# Altium schematic sheet DRV8301.SchDoc
size A4
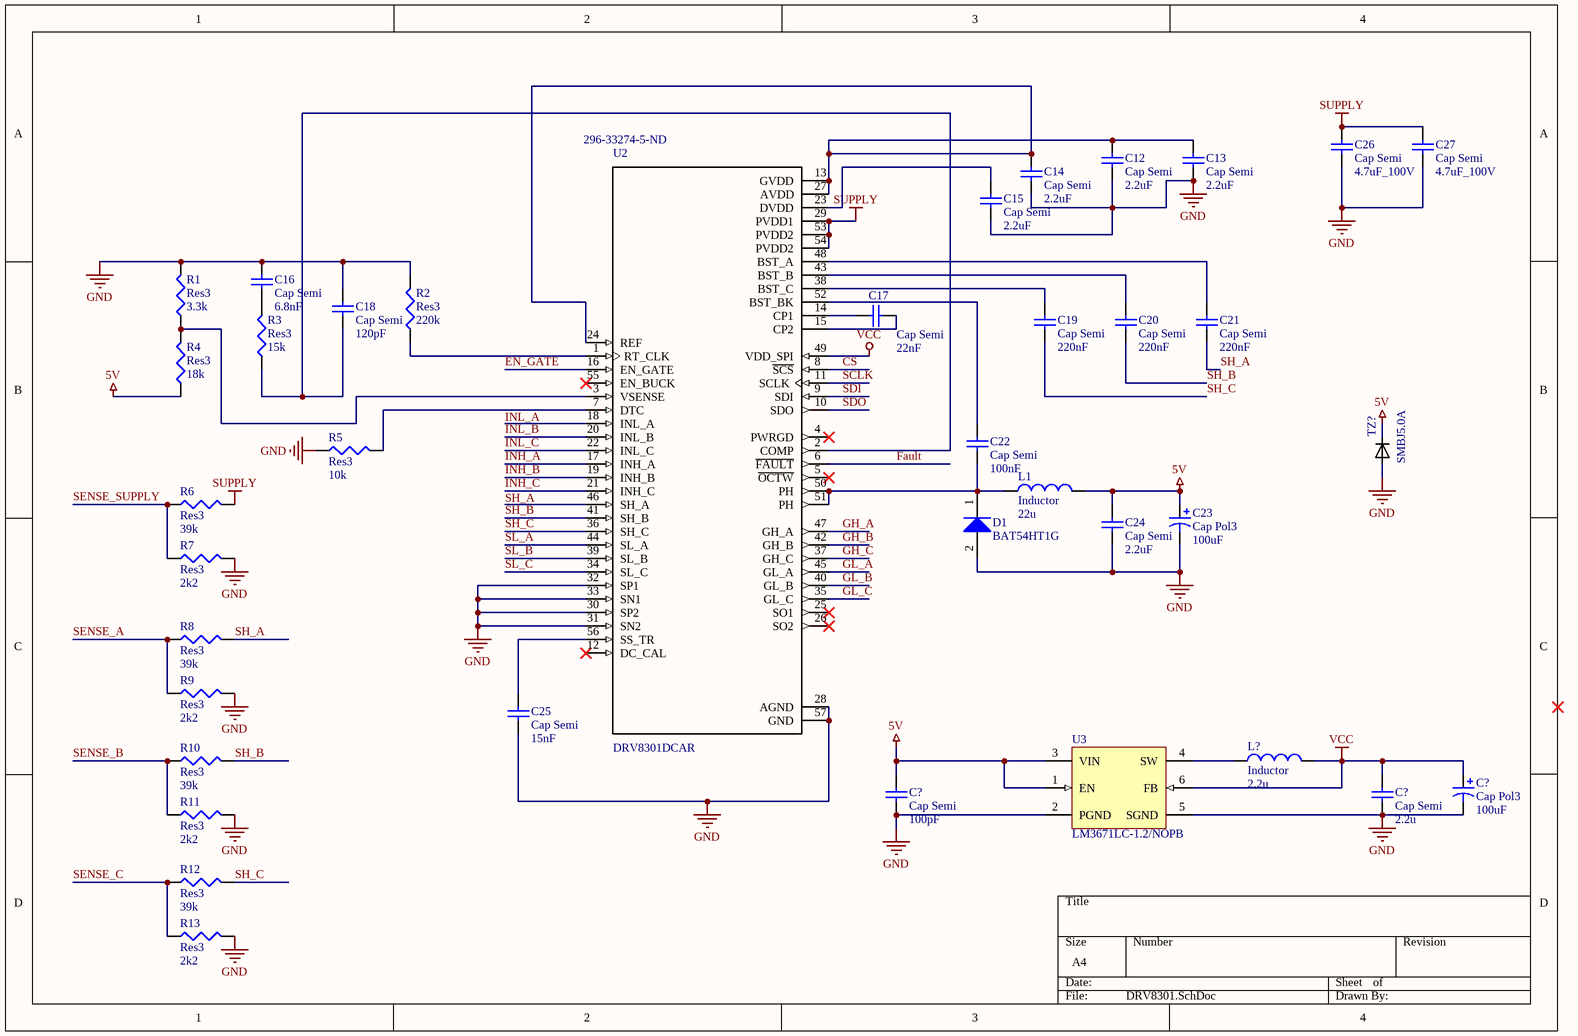
[diagram p0: DRV8301.SchDoc]

## Parts
(Parts that share a designator on the sheet are numbered #1, #2 ... from top to bottom, then left to right.)
C12  Cap Semi  value 2.2uF  [C1206]
C13  Cap Semi  value 2.2uF  [C1206]
C14  Cap Semi  value 2.2uF  [C1206]
C15  Cap Semi  value 2.2uF  [C1206]
C16  Cap Semi  value 6.8nF  [C1206]
C17  Cap Semi  value 22nF  [C1206]
C18  Cap Semi  value 120pF  [C1206]
C19  Cap Semi  value 220nF  [C1206]
C20  Cap Semi  value 220nF  [C1206]
C21  Cap Semi  value 220nF  [C1206]
C22  Cap Semi  value 100nF  [C1206]
C23  Cap Pol3  value 100uF  [C0805]
C24  Cap Semi  value 2.2uF  [C1206]
C25  Cap Semi  value 15nF  [C1206]
C26  Cap Semi  value 4.7uF_100V  [C1206]
C27  Cap Semi  value 4.7uF_100V  [C1206]
C?#1  Cap Pol3  value 100uF  [C0805]
C?#2  Cap Semi  value 100pF  [C1206]
C?#3  Cap Semi  value 2.2u  [C1206]
D1  BAT54HT1G  [ONSC-SOD-323-2-477-02_V]
L1  Inductor  value 22u  [0402-A]
L?  Inductor  value 2.2u  [0402-A]
R1  Res3  value 3.3k  [J1-0603]
R2  Res3  value 220k  [J1-0603]
R3  Res3  value 15k  [J1-0603]
R4  Res3  value 18k  [J1-0603]
R5  Res3  value 10k  [J1-0603]
R6  Res3  value 39k  [J1-0603]
R7  Res3  value 2k2  [J1-0603]
R8  Res3  value 39k  [J1-0603]
R9  Res3  value 2k2  [J1-0603]
R10  Res3  value 39k  [J1-0603]
R11  Res3  value 2k2  [J1-0603]
R12  Res3  value 39k  [J1-0603]
R13  Res3  value 2k2  [J1-0603]
TZ?  SMBJ5.0A  [*SMB_SMBJ5.0A(Primary)]
U2  DRV8301DCAR  Supplier Part Number 1: 296-33274-5-ND  [*SOP50P810X120-57N]
U3  LM3671LC-1.2/NOPB  [NKH0006B_V]

## Nets
5V: C23.1 C24.2 C?#2.2 L1.2 R4.1 TZ?.C U3.1(EN) U3.3(VIN)
GND: C12.2 C13.2 C14.2 C15.2 C16.2 C18.2 C23.2 C24.1 C25.2 C26.1 C27.1 C?#1.2 C?#2.1 C?#3.1 D1.2(A) R1.2 R2.2 R5.1 R7.2 R9.2 R11.2 R13.2 TZ?.A U2.28(AGND) U2.30(SP2) U2.31(SN2) U2.32(SP1) U2.33(SN1) U2.57(GND) U3.2(PGND) U3.5(SGND)
SUPPLY: C26.2 C27.2 R6.2 U2.29(PVDD1) U2.53(PVDD2) U2.54(PVDD2)
VCC: C?#1.1 C?#3.2 L?.2 U2.49(VDD_SPI) U3.6(FB)
CS: U2.8(~{SCS})
EN_GATE: U2.16(EN_GATE)
Fault: U2.6(~{FAULT})
GH_A: U2.47(GH_A)
GH_B: U2.42(GH_B)
GH_C: U2.37(GH_C)
GL_A: U2.45(GL_A)
GL_B: U2.40(GL_B)
GL_C: U2.35(GL_C)
INH_A: U2.17(INH_A)
INH_B: U2.19(INH_B)
INH_C: U2.21(INH_C)
INL_B: U2.20(INL_B)
INL_C: U2.22(INL_C)
SCLK: U2.11(SCLK)
SDI: U2.9(SDI)
SDO: U2.10(SDO)
SENSE_A: R8.1 R9.1
SENSE_B: R10.1 R11.1
SENSE_C: R12.1 R13.1
SENSE_SUPPLY: R6.1 R7.1
SH_A: C21.2 R8.2
SH_B: C20.2 R10.2 U2.41(SH_B)
SH_C: C19.2 R12.2 U2.36(SH_C)
SL_A: U2.44(SL_A)
SL_B: U2.39(SL_B)
SL_C: U2.34(SL_C)
NetC12_1: C12.1 C13.1 C14.1 U2.13(GVDD) U2.24(REF) U2.27(AVDD)
NetC15_1: C15.1 U2.23(DVDD)
NetC16_1: C16.1 R3.2
NetC17_1: C17.1 U2.14(CP1)
NetC17_2: C17.2 U2.15(CP2)
NetC18_1: C18.1 R3.1 U2.2(COMP)
NetC19_1: C19.1 U2.38(BST_C)
NetC20_1: C20.1 U2.43(BST_B)
NetC21_1: C21.1 U2.48(BST_A)
NetC22_1: C22.1 D1.1(K) L1.1 U2.50(PH) U2.51(PH)
NetC22_2: C22.2 U2.52(BST_BK)
NetC25_1: C25.1 U2.56(SS_TR)
NetL?_1: L?.1 U3.4(SW)
NetR1_1: R1.1 R4.2 U2.3(VSENSE)
NetR2_1: R2.1 U2.1(RT_CLK)
NetR5_2: R5.2 U2.7(DTC)

Not connected (* = marked no-connect by the designer): U2 4(PWRGD)* 5(~{OCTW})* 12(DC_CAL)* 18(INL_A) 25(SO1)* 26(SO2)* 46(SH_A) 55(EN_BUCK)*

## Notes on the sheet
- Labels drawn without touching a wire or pin: INL_A, SH_A

## Library data of the parts
C12-C22 C24-C27 C?#2 C?#3 = Cap Semi: Capacitor (Semiconductor SIM Model); Published: 8-Jun-2000; LatestRevisionDate: 29-May-2009; LatestRevisionNote: IPC-7351 Footprint Added.; PackageReference: C1206; Publisher: Altium Limited; PackageDescription: Chip Capacitor
C23 C?#1 = Cap Pol3: Polarized Capacitor (Surface Mount); Published: 8-Jun-2000; LatestRevisionDate: 29-May-2009; LatestRevisionNote: IPC-7351 Footprint Added.; PackageReference: C0805; Publisher: Altium Limited; PackageDescription: Chip Capacitor
D1 = CMP-1055-00462-1: Schottky Barrier Diode, 2-Pin SOD-323, Pb-Free, Tape and Reel; Manufacturer: On Semiconductor; Configuration: Single; trr Max (ns): 5; IFSM Max (A): 0.6; ComponentLink3URL: http://www.onsemi.com/pub_link/Collateral/477-02.PDF.1; PackageDescription: 2-Pin SOD, Body 1.7 x 1.25 mm; ComponentLink2URL: http://www.onsemi.cn/pub_link/Collateral/BAT54HT1-D.PDF; ComponentLink3Description: Package Specification; ComponentLink2Description: Datasheet; DatasheetVersion: Rev. 6; PackageReference: SOD-323-2-477-02; RoHS: TRUE; ComponentLink1URL: http://www.onsemi.com/; Packing: Tape and Reel; PartNumber: BAT54HT1G; Mounting Technology: Surface Mount; ComponentLink1Description: Manufacturer URL; PackageVersion: Rev. H, 03/2007
L1 L? = Inductor: Code_IEC: 1005; Published: 8-Jun-2000; LatestRevisionDate: 29-May-2009; LatestRevisionNote: IPC-7351 Footprint Added.; PackageReference: 0402-A; Publisher: Altium Limited; PackageDescription: Chip Inductor; Code_JEITA: 0402
R1-R13 = Res3: Resistor; Published: 8-Jun-2000; LatestRevisionDate: 29-May-2009; LatestRevisionNote: IPC-7351 Footprint Added.; PackageReference: J1-0603; Publisher: Altium Limited; PackageDescription: Chip Resistor
TZ? = SMBJ5.0A: 9.2V Clamp 65.3A Ipp Tvs Diode Surface Mount SMB _DO-214AA_; MF: Littelfuse; SnapEDA_Link: https://www.snapeda.com/parts/SMBJ5.0A/Littelfuse%20Inc/view-part/225678/?ref=snap; Price: None; Availability: Unavailable; MP: SMBJ5.0A; Package: DO-214 Bourns; Value: *
U2 = DRV8301DCAR: Motor Driver Power MOSFET SPI 56-HTSSOP; MF: Texas Instruments; MP: DRV8301DCAR; Package: HTSSOP-56 Texas Instruments; SnapEDA_Link: https://www.snapeda.com/parts/DRV8301DCAR/Texas%20Instruments/view-part/46687/?ref=snap; Price: None; Availability: Unavailable; Value: *; Supplier 1: Digi-Key
U3 = CMP-0063-00712-3: 2MHz, 600mA Step-Down DC-DC Converter, 6-pin LLP COL, Pb-Free; Manufacturer: Texas Instruments; PackageTopMarking: XTT*S39; PowerWise: N; CompType: MiscPower; RoHS: Y; PackageReference: NKH0006B; ComponentLink1URL: http://www.ti.com/general/docs/lit/getliterature.tsp?genericPartNumber=LM3671&fileType=pdf; PinCount: 6; PackageDescription: LLP, 2 x 2 x 0.6mm, 6 Lead, 0.5mm Pitch, No Pullback; ComponentLink1Description: Datasheet URL